# Altium schematic sheet Page05 DDR4L+eMMC.SchDoc
size 513 x 386 mm; SheetNumber: 5; SheetTotal: 13
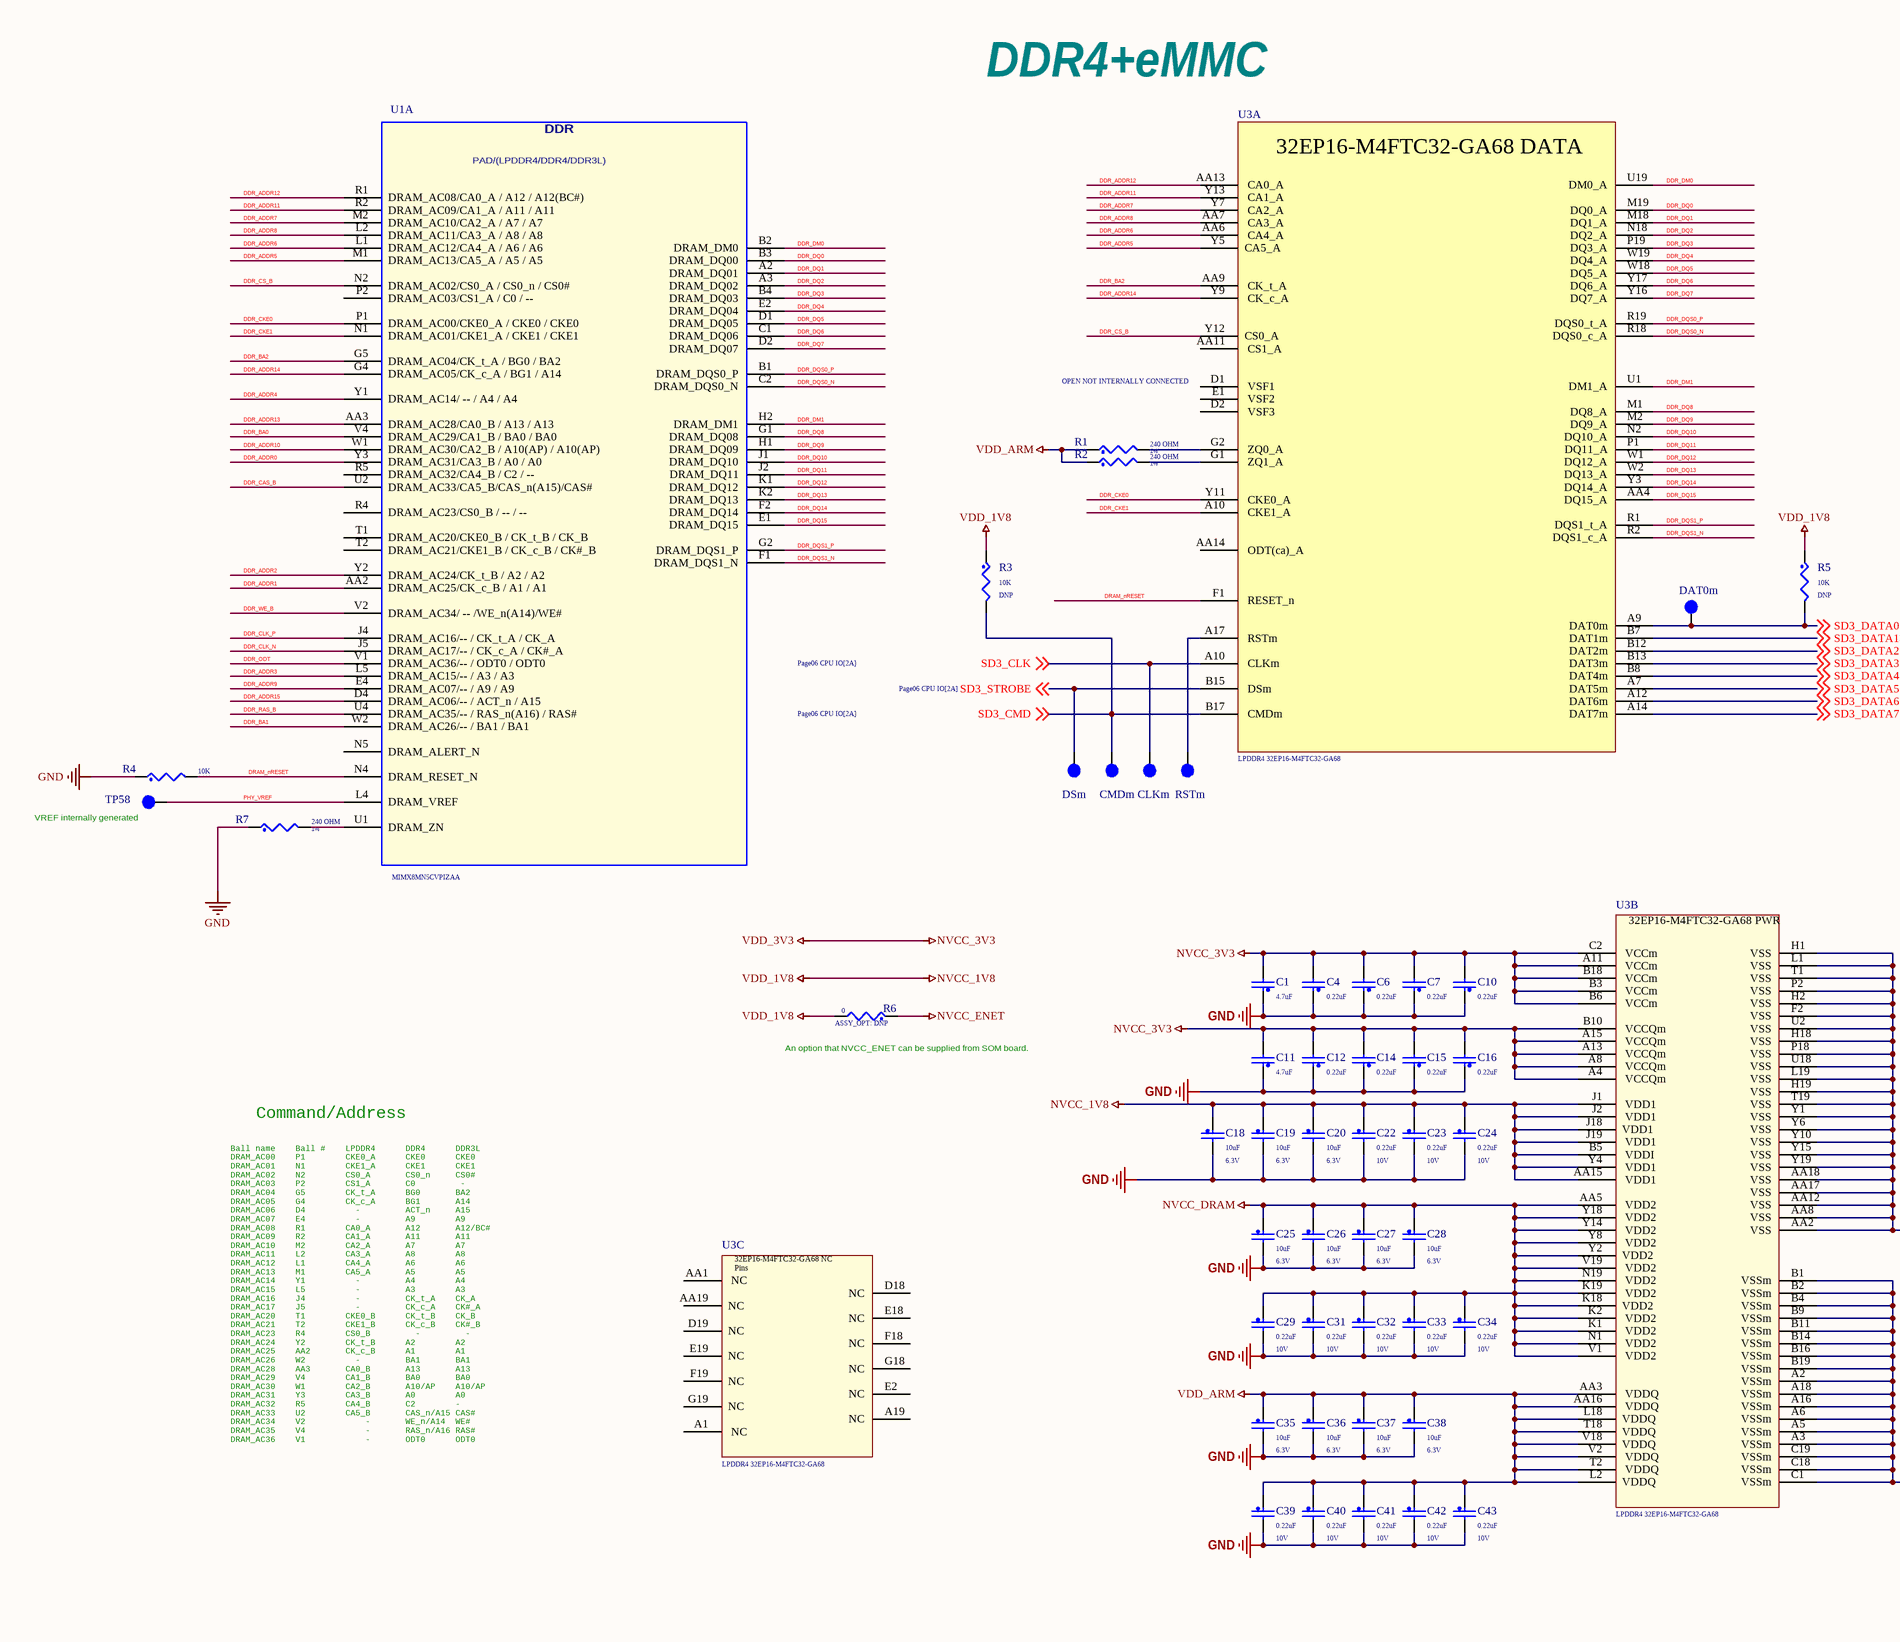
[diagram p0: Page05 DDR4L+eMMC.SchDoc, left]
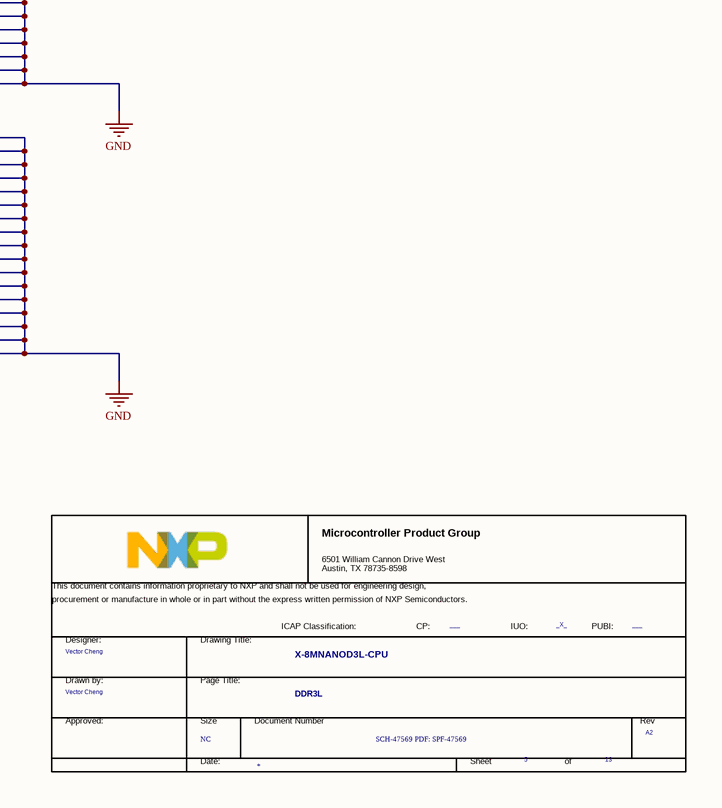
[diagram p1: Page05 DDR4L+eMMC.SchDoc, right]

## Parts
*  FCP: ___  FIUO: _X_  DrawnBy: Vector Cheng  PageTitle: DDR3L  Page Count: 13  Page Number: 5  Page Size: NC  Title: X-8MNANOD3L-CPU  RevCode: A2  Doc: SCH-47569 PDF: SPF-47569  (hidden comment: TitleBlock_MCPG)  (graphical)
C1  4.7uF  [0402_CC - C]
C4  0.22uF  [0201_CC - C]
C6  0.22uF  [0201_CC - C]
C7  0.22uF  [0201_CC - C]
C10  0.22uF  [0201_CC - C]
C11  4.7uF  [0402_CC - C]
C12  0.22uF  [0201_CC - C]
C14  0.22uF  [0201_CC - C]
C15  0.22uF  [0201_CC - C]
C16  0.22uF  [0201_CC - C]
C18  10uF  Voltage: 6.3V  [0402_CC - C]
C19  10uF  Voltage: 6.3V  [0402_CC - C]
C20  10uF  Voltage: 6.3V  [0402_CC - C]
C22  0.22uF  Voltage: 10V  [0201_CC - C]
C23  0.22uF  Voltage: 10V  [0201_CC - C]
C24  0.22uF  Voltage: 10V  [0201_CC - C]
C25  10uF  Voltage: 6.3V  [0402_CC - C]
C26  10uF  Voltage: 6.3V  [0402_CC - C]
C27  10uF  Voltage: 6.3V  [0402_CC - C]
C28  10uF  Voltage: 6.3V  [0402_CC - C]
C29  0.22uF  Voltage: 10V  [0201_CC - C]
C31  0.22uF  Voltage: 10V  [0201_CC - C]
C32  0.22uF  Voltage: 10V  [0201_CC - C]
C33  0.22uF  Voltage: 10V  [0201_CC - C]
C34  0.22uF  Voltage: 10V  [0201_CC - C]
C35  10uF  Voltage: 6.3V  [0402_CC - C]
C36  10uF  Voltage: 6.3V  [0402_CC - C]
C37  10uF  Voltage: 6.3V  [0402_CC - C]
C38  10uF  Voltage: 6.3V  [0402_CC - C]
C39  0.22uF  Voltage: 10V  [0201_CC - C]
C40  0.22uF  Voltage: 10V  [0201_CC - C]
C41  0.22uF  Voltage: 10V  [0201_CC - C]
C42  0.22uF  Voltage: 10V  [0201_CC - C]
C43  0.22uF  Voltage: 10V  [0201_CC - C]
CLKm  tpad_020  [Test Pin]  (value not drawn)  (graphical)
CMDm  TPAD_015  [Test Pin]  (value not drawn)  (graphical)
DAT0m  tpad_020  [Test Pin]  (value not drawn)  (graphical)
DSm  TPAD_015  [Test Pin]  (value not drawn)  (graphical)
R1  240 OHM  Tolerance: 1%  [0201_RES]
R2  240 OHM  Tolerance: 1%  [0201_RES]
R3  10K  ASSY_OPT: DNP  [0201_RES]
R4  10K  [0201_RES]
R5  10K  ASSY_OPT: DNP  [0201_RES]
R6  0  ASSY_OPT: DNP  [0402_CC_RES]
R7  240 OHM  Tolerance: 1%  [0201_RES]
RSTm  tpad_020  [Test Pin]  (value not drawn)  (graphical)
TP58  tpad_020  [Test Pin]  (value not drawn)  (graphical)
U1  MIMX8MN5CVPIZAA  [BGA306C50P21X21_1100X1100X101]  (part A of 12)
U3  LPDDR4 32EP16-M4FTC32-GA68  [FBGA144C40P19X21_800X950X80]  (parts A,B,C of 3)

## Nets
GND: C1.1 C4.1 C6.1 C7.1 C10.1 C11.1 C12.1 C14.1 C15.1 C16.1 C18.2 C19.2 C20.2 C22.2 C23.2 C24.2 C25.2 C26.2 C27.2 C28.2 C29.2 C31.2 C32.2 C33.2 C34.2 C35.2 C36.2 C37.2 C38.2 C39.2 C40.2 C41.2 C42.2 C43.2 R4.1 R7.1 U3.A2(VSSm) U3.A3(VSSm) U3.A5(VSSm) U3.A6(VSSm) U3.A16(VSSm) U3.A18(VSSm) U3.AA2(VSS) U3.AA8(VSS) U3.AA12(VSS) U3.AA17(VSS) U3.AA18(VSS) U3.B1(VSSm) U3.B2(VSSm) U3.B4(VSSm) U3.B9(VSSm) U3.B11(VSSm) U3.B14(VSSm) U3.B16(VSSm) U3.B19(VSSm) U3.C1(VSSm) U3.C18(VSSm) U3.C19(VSSm) U3.F2(VSS) U3.H1(VSS) U3.H2(VSS) U3.H18(VSS) U3.H19(VSS) U3.L1(VSS) U3.L19(VSS) U3.P2(VSS) U3.P18(VSS) U3.T1(VSS) U3.T19(VSS) U3.U2(VSS) U3.U18(VSS) U3.Y1(VSS) U3.Y6(VSS) U3.Y10(VSS) U3.Y15(VSS) U3.Y19(VSS)
NVCC_1V8: C18.1 C19.1 C20.1 C22.1 C23.1 C24.1 R3.1 R5.1 R6.2 U3.AA15(VDD1) U3.B5(VDDI) U3.J1(VDD1) U3.J2(VDD1) U3.J18(VDD1) U3.J19(VDD1) U3.Y4(VDD1)  [also labelled VDD_1V8]
NVCC_3V3: C1.2 C4.2 C6.2 C7.2 C10.2 C11.2 C12.2 C14.2 C15.2 C16.2 U3.A4(VCCQm) U3.A8(VCCQm) U3.A11(VCCm) U3.A13(VCCQm) U3.A15(VCCQm) U3.B3(VCCm) U3.B6(VCCm) U3.B10(VCCQm) U3.B18(VCCm) U3.C2(VCCm)  [also labelled VDD_3V3]
NVCC_DRAM: C25.1 C26.1 C27.1 C28.1 C29.1 C31.1 C32.1 C33.1 C34.1 U3.AA5(VDD2) U3.K1(VDD2) U3.K2(VDD2) U3.K18(VDD2) U3.K19(VDD2) U3.N1(VDD2) U3.N19(VDD2) U3.V1(VDD2) U3.V19(VDD2) U3.Y2(VDD2) U3.Y8(VDD2) U3.Y14(VDD2) U3.Y18(VDD2)
NVCC_ENET: R6.1
VDD_ARM: C35.1 C36.1 C37.1 C38.1 C39.1 C40.1 C41.1 C42.1 C43.1 R1.1 R2.1 U3.AA3(VDDQ) U3.AA16(VDDQ) U3.L2(VDDQ) U3.L18(VDDQ) U3.T2(VDDQ) U3.T18(VDDQ) U3.V2(VDDQ) U3.V18(VDDQ)
DDR_ADDR0: U1.Y3(DRAM_AC31/CA3_B_/_A0_/_A0)
DDR_ADDR1: U1.AA2(DRAM_AC25/CK_c_B_/_A1_/_A1)
DDR_ADDR2: U1.Y2(DRAM_AC24/CK_t_B_/_A2_/_A2)
DDR_ADDR3: U1.L5(DRAM_AC15/--_/_A3_/_A3)
DDR_ADDR4: U1.Y1(DRAM_AC14/_--_/_A4_/_A4)
DDR_ADDR5: U1.M1(DRAM_AC13/CA5_A_/_A5_/_A5) U3.Y5(CA5_A)
DDR_ADDR6: U1.L1(DRAM_AC12/CA4_A_/_A6_/_A6) U3.AA6(CA4_A)
DDR_ADDR7: U1.M2(DRAM_AC10/CA2_A_/_A7_/_A7) U3.Y7(CA2_A)
DDR_ADDR8: U1.L2(DRAM_AC11/CA3_A_/_A8_/_A8) U3.AA7(CA3_A)
DDR_ADDR9: U1.E4(DRAM_AC07/--_/_A9_/_A9)
DDR_ADDR10: U1.W1(DRAM_AC30/CA2_B_/_A10(AP)_/_A10(AP))
DDR_ADDR11: U1.R2(DRAM_AC09/CA1_A_/_A11_/_A11) U3.Y13(CA1_A)
DDR_ADDR12: U1.R1(DRAM_AC08/CA0_A_/_A12_/_A12(BC#)) U3.AA13(CA0_A)
DDR_ADDR13: U1.AA3(DRAM_AC28/CA0_B_/_A13_/_A13)
DDR_ADDR14: U1.G4(DRAM_AC05/CK_c_A_/_BG1_/_A14) U3.Y9(CK_c_A)
DDR_ADDR15: U1.D4(DRAM_AC06/--_/_ACT_n_/_A15)
DDR_BA0: U1.V4(DRAM_AC29/CA1_B_/_BA0_/_BA0)
DDR_BA1: U1.W2(DRAM_AC26/--_/_BA1_/_BA1)
DDR_BA2: U1.G5(DRAM_AC04/CK_t_A_/_BG0_/_BA2) U3.AA9(CK_t_A)
DDR_CAS_B: U1.U2(DRAM_AC33/CA5_B/CAS_n(A15)/CAS#)
DDR_CKE0: U1.P1(DRAM_AC00/CKE0_A_/_CKE0_/_CKE0) U3.Y11(CKE0_A)
DDR_CKE1: U1.N1(DRAM_AC01/CKE1_A_/_CKE1_/_CKE1) U3.A10(CKE1_A)
DDR_CLK_N: U1.J5(DRAM_AC17/--_/_CK_c_A_/_CK#_A)
DDR_CLK_P: U1.J4(DRAM_AC16/--_/_CK_t_A_/_CK_A)
DDR_CS_B: U1.N2(DRAM_AC02/CS0_A_/_CS0_n_/_CS0#) U3.Y12(CS0_A)
DDR_DM0: U1.B2(DRAM_DM0) U3.U19(DM0_A)
DDR_DM1: U1.H2(DRAM_DM1) U3.U1(DM1_A)
DDR_DQ0: U1.B3(DRAM_DQ00) U3.M19(DQ0_A)
DDR_DQ1: U1.A2(DRAM_DQ01) U3.M18(DQ1_A)
DDR_DQ2: U1.A3(DRAM_DQ02) U3.N18(DQ2_A)
DDR_DQ3: U1.B4(DRAM_DQ03) U3.P19(DQ3_A)
DDR_DQ4: U1.E2(DRAM_DQ04) U3.W19(DQ4_A)
DDR_DQ5: U1.D1(DRAM_DQ05) U3.W18(DQ5_A)
DDR_DQ6: U1.C1(DRAM_DQ06) U3.Y17(DQ6_A)
DDR_DQ7: U1.D2(DRAM_DQ07) U3.Y16(DQ7_A)
DDR_DQ8: U1.G1(DRAM_DQ08) U3.M1(DQ8_A)
DDR_DQ9: U1.H1(DRAM_DQ09) U3.M2(DQ9_A)
DDR_DQ10: U1.J1(DRAM_DQ10) U3.N2(DQ10_A)
DDR_DQ11: U1.J2(DRAM_DQ11) U3.P1(DQ11_A)
DDR_DQ12: U1.K1(DRAM_DQ12) U3.W1(DQ12_A)
DDR_DQ13: U1.K2(DRAM_DQ13) U3.W2(DQ13_A)
DDR_DQ14: U1.F2(DRAM_DQ14) U3.Y3(DQ14_A)
DDR_DQ15: U1.E1(DRAM_DQ15) U3.AA4(DQ15_A)
DDR_DQS0_N: U1.C2(DRAM_DQS0_N) U3.R18(DQS0_c_A)
DDR_DQS0_P: U1.B1(DRAM_DQS0_P) U3.R19(DQS0_t_A)
DDR_DQS1_N: U1.F1(DRAM_DQS1_N) U3.R2(DQS1_c_A)
DDR_DQS1_P: U1.G2(DRAM_DQS1_P) U3.R1(DQS1_t_A)
DDR_ODT: U1.V1(DRAM_AC36/--_/_ODT0_/_ODT0)
DDR_RAS_B: U1.U4(DRAM_AC35/--_/_RAS_n(A16)_/_RAS#)
DDR_WE_B: U1.V2(DRAM_AC34/_--_/WE_n(A14)/WE#)
DRAM_nRESET: R4.2 U1.N4(DRAM_RESET_N) U3.F1(RESET_n)
PHY_VREF: TP58.1(Pin1) U1.L4(DRAM_VREF)
SD3_CLK: CLKm.1(Pin1) U3.A10(CLKm) ; off-sheet SD3_CLK
SD3_CMD: CMDm.1(Pin1) R3.2 U3.B17(CMDm) ; off-sheet SD3_CMD
SD3_DATA0: DAT0m.1(Pin1) R5.2 U3.A9(DAT0m) ; off-sheet SD3_DATA0
SD3_DATA1: U3.B7(DAT1m) ; off-sheet SD3_DATA1
SD3_DATA2: U3.B12(DAT2m) ; off-sheet SD3_DATA2
SD3_DATA3: U3.B13(DAT3m) ; off-sheet SD3_DATA3
SD3_DATA4: U3.B8(DAT4m) ; off-sheet SD3_DATA4
SD3_DATA5: U3.A7(DAT5m) ; off-sheet SD3_DATA5
SD3_DATA6: U3.A12(DAT6m) ; off-sheet SD3_DATA6
SD3_DATA7: U3.A14(DAT7m) ; off-sheet SD3_DATA7
SD3_STROBE: DSm.1(Pin1) U3.B15(DSm) ; off-sheet SD3_STROBE
NetR1_2: R1.2 U3.G2(ZQ0_A)
NetR2_2: R2.2 U3.G1(ZQ1_A)
NetR7_2: R7.2 U1.U1(DRAM_ZN)
NetRSTm_1: RSTm.1(Pin1) U3.A17(RSTm)

Not connected (* = marked no-connect by the designer): U1 N5(DRAM_ALERT_N) P2(DRAM_AC03/CS1_A_/_C0_/_--) R4(DRAM_AC23/CS0_B_/_--_/_--) R5(DRAM_AC32/CA4_B_/_C2_/_--) T1(DRAM_AC20/CKE0_B_/_CK_t_B_/_CK_B) T2(DRAM_AC21/CKE1_B_/_CK_c_B_/_CK#_B); U3 A1(_NC) A19(NC) AA1(_NC) AA11(_CS1_A) AA14(_ODT(ca)_A) AA19(NC) D1(_VSF1) D2(_VSF3) D18(NC) D19(NC) E1(_VSF2) E2(NC) E18(NC) E19(NC) F18(NC) F19(NC) G18(NC) G19(NC)

## Notes on the sheet
- DDR4+eMMC
- OPEN NOT INTERNALLY CONNECTED
- VREF internally generated
- (near R6) An option that NVCC_ENET can be supplied from SOM board.
- Command/Address
- Ball name    Ball #    LPDDR4      DDR4      DDR3L
  DRAM_AC00    P1        CKE0_A      CKE0      CKE0
  DRAM_AC01    N1        CKE1_A      CKE1      CKE1
  DRAM_AC02    N2        CS0_A       CS0_n     CS0#
  DRAM_AC03    P2        CS1_A       C0         -
  DRAM_AC04    G5        CK_t_A      BG0       BA2
  DRAM_AC05    G4        CK_c_A      BG1       A14
  DRAM_AC06    D4          -         ACT_n     A15
  DRAM_AC07    E4          -         A9        A9
  DRAM_AC08    R1        CA0_A       A12       A12/BC#
  DRAM_AC09    R2        CA1_A       A11       A11
  DRAM_AC10    M2        CA2_A       A7        A7
  DRAM_AC11    L2        CA3_A       A8        A8
  DRAM_AC12    L1        CA4_A       A6        A6
  DRAM_AC13    M1        CA5_A       A5        A5
  DRAM_AC14    Y1          -         A4        A4
  DRAM_AC15    L5          -         A3        A3
  DRAM_AC16    J4          -         CK_t_A    CK_A
  DRAM_AC17    J5          -         CK_c_A    CK#_A
  DRAM_AC20    T1        CKE0_B      CK_t_B    CK_B
  DRAM_AC21    T2        CKE1_B      CK_c_B    CK#_B
  DRAM_AC23    R4        CS0_B         -         -
  DRAM_AC24    Y2        CK_t_B      A2        A2
  DRAM_AC25    AA2       CK_c_B      A1        A1
  DRAM_AC26    W2          -         BA1       BA1
  DRAM_AC28    AA3       CA0_B       A13       A13
  DRAM_AC29    V4        CA1_B       BA0       BA0
  DRAM_AC30    W1        CA2_B       A10/AP    A10/AP
  DRAM_AC31    Y3        CA3_B       A0        A0
  DRAM_AC32    R5        CA4_B       C2        -
  DRAM_AC33    U2        CA5_B       CAS_n/A15 CAS#
  DRAM_AC34    V2            -       WE_n/A14  WE#
  DRAM_AC35    V4            -       RAS_n/A16 RAS#
  DRAM_AC36    V1            -       ODT0      ODT0
- (in symbol LPDDR4 32EP16-M4FTC32-GA68, part A) 32EP16-M4FTC32-GA68 DATA
- (in symbol LPDDR4 32EP16-M4FTC32-GA68, part B) 32EP16-M4FTC32-GA68 PWR
- (in symbol LPDDR4 32EP16-M4FTC32-GA68, part C) 32EP16-M4FTC32-GA68 NC Pins
- (in symbol MIMX8MN, part A) DDR; PAD/(LPDDR4/DDR4/DDR3L)
- (in symbol TitleBlock_MCPG) Microcontroller Product Group; 6501 William Cannon Drive West / Austin, TX 78735-8598; This document contains information proprietary to NXP and shall not be used for engineering design,; procurement or manufacture in whole or in part without the express written permission of NXP Semiconductors.; ICAP Classification:; CP:; IUO:; PUBI:; Designer:; Drawing Title:; Drawn by:; Page Title:; Approved:; Size; Document Number; Rev; Date:; Sheet; of

## Library data of the parts
* = TitleBlock_MCPG: OrgAddr1: NO. 192 Liangjing Rd. Pudong New Area, ShangHai; OrgName: NXP Semiconductor; PUBI: ___; Designer: Vector Cheng; Page Create Date: March  8, 1995; Page Modify Date: *
C1 C4 C6 C10-C12 C14 C16 C18-C20 C22-C29 C31-C43 = CAP_NP: CLASS: DISCRETE
C7 C15 = CAP_NP
CLKm = TESTLOOP: TEST POINT PAD 0.5MM DIA SMT, NO PART TO ORDER; ASSY_OPT: DNP; CLASS: IO; AGILE_PN: 211-77484; CAD_APPROVED: Yes; PCB Footprint: tpad_020; ROHS: Yes; HEIGHT: 0.1MM
CMDm = TESTLOOP: TEST POINT PAD 15MIL DIA SMT, NO PART TO ORDER; ASSY_OPT: DNP; CLASS: IO; CAD_APPROVED: Yes; MFG_PN01: NOTACOMPONENT; AGILE_PN: 211-76645; PCB Footprint: TPAD_015; HEIGHT: 0.1MM; ROHS: Yes; MFG_NAME01: NOTACOMPONENT
DAT0m RSTm TP58 = TESTLOOP: TEST POINT PAD 0.5MM DIA SMT, NO PART TO ORDER; ASSY_OPT: DNP; CLASS: IO; CAD_APPROVED: Yes; AGILE_PN: 211-77484; PCB Footprint: tpad_020; HEIGHT: 0.1MM; ROHS: Yes
DSm = TESTLOOP: TEST POINT PAD 15MIL DIA SMT, NO PART TO ORDER; CLASS: IO; CAD_APPROVED: Yes; MFG_PN01: NOTACOMPONENT; AGILE_PN: 211-76645; PCB Footprint: TPAD_015; HEIGHT: 0.1MM; ROHS: Yes; MFG_NAME01: NOTACOMPONENT
R1 R2 R7 = RES: RES MF 240 OHM 1/20W 1% 0201; CLASS: DISCRETE; Temp Range: -55¡ãC ~ 125¡ãC; VOLTAGE: 25V; PCB Footprint: 0201_CC; FPLIST: CC0201,CC0201_HD,0201_CC; CAD_APPROVED: Yes; MFG_PN01: RC0201FR-07240RL; MFG_NAME01: YAGEO AMERICA; AGILE_PN: 470-81317; HEIGHT: 0.26MM; Temp_Range: -55¡ãC ~ 125¡ãC; ROHS: Yes
R3 R5 = RES: RES MF 10K 1/20W 5% 0201; CLASS: DISCRETE; PCB Footprint: 0201_CC; AGILE_PN: 470-79719; MFG_NAME01: RALEC ELECTRONIC CORP; MFG_PN01: RTT01103JTH; CAD_APPROVED: Yes; FPLIST: RC0201,0201_CC; Tolerance: 5%; ROHS: Yes; HEIGHT: 0.26 MM
R4 = RES: RES MF 10K 1/20W 5% 0201; CLASS: DISCRETE; PCB Footprint: 0201_CC; FPLIST: RC0201,0201_CC; CAD_APPROVED: Yes; MFG_PN01: RTT01103JTH; MFG_NAME01: RALEC ELECTRONIC CORP; AGILE_PN: 470-79719; HEIGHT: 0.26 MM; ROHS: Yes; Tolerance: 5%
R6 = RES: RES MF ZERO OHM 1/16W 5% 0402; CLASS: DISCRETE; AGILE_PN: 470-75394; MFG_NAME01: YAGEO AMERICA; MFG_PN01: RC0402JR-070RL; CAD_APPROVED: Yes; FPLIST: RC0402_25,RC0402_HD,RC0402_X2,0402_CC; PCB Footprint: 0402_CC; Tolerance: 5%; ROHS: Yes; HEIGHT: 0.45 MM; VOLTAGE: 1/16W
U1 = MIMX8MN: IC CPU QUAD CORTEX A53+M7 1.4GHZ -- BGA306; PCB Footprint: pbga306_0p5_sq11mm; MFG_NAME01: NXP SEMICONDUCTORS; Temp Range: -40¡ãC to 105¡ãC; PRE_APN: 330-77152; CAD_APPROVED: Yes; AGILE_PN: TMP-CIP-5098; CLASS: IC; MFG_PN01: MIMX8MN5CVPIZAA; ROHS: Yes; HEIGHT: 1.01MM